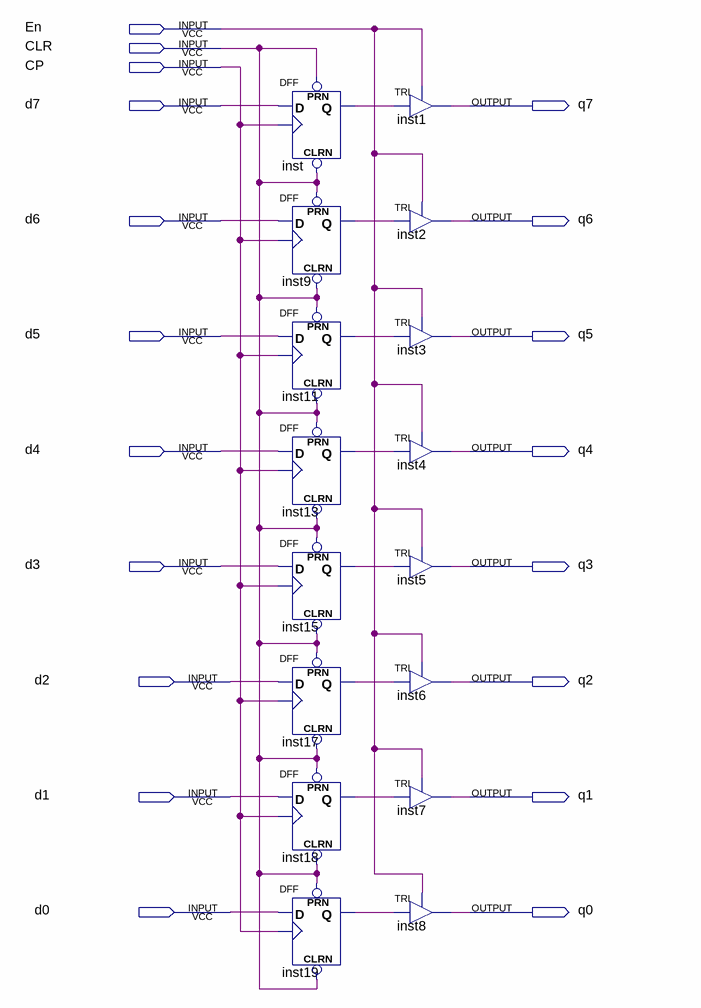
[diagram p0: schematic sheet]
// Quartus schematic TriEn.bdf as structural Verilog: 16 symbols, 19 pins
module TriEn (
  input  En,
  input  CLR,
  input  CP,
  input  d7,
  input  d6,
  input  d5,
  input  d4,
  input  d3,
  input  d2,
  input  d1,
  input  d0,
  output q7,
  output q6,
  output q5,
  output q4,
  output q3,
  output q2,
  output q1,
  output q0
);

  wire inst9_q, inst11_q, inst13_q, inst15_q, inst17_q, inst18_q, inst19_q, inst_q;

  DFF inst (.CLRN(CLR), .CLK(CP), .D(d7), .PRN(CLR), .Q(inst_q));
  DFF inst9 (.CLRN(CLR), .CLK(CP), .D(d6), .PRN(CLR), .Q(inst9_q));
  DFF inst11 (.CLRN(CLR), .CLK(CP), .D(d5), .PRN(CLR), .Q(inst11_q));
  DFF inst13 (.CLRN(CLR), .CLK(CP), .D(d4), .PRN(CLR), .Q(inst13_q));
  DFF inst15 (.CLRN(CLR), .CLK(CP), .D(d3), .PRN(CLR), .Q(inst15_q));
  DFF inst17 (.CLRN(CLR), .CLK(CP), .D(d2), .PRN(CLR), .Q(inst17_q));
  DFF inst18 (.CLRN(CLR), .CLK(CP), .D(d1), .PRN(CLR), .Q(inst18_q));
  DFF inst19 (.CLRN(CLR), .CLK(CP), .D(d0), .PRN(CLR), .Q(inst19_q));
  TRI inst1 (.IN(inst_q), .OE(En), .OUT(q7));
  TRI inst2 (.IN(inst9_q), .OE(En), .OUT(q6));
  TRI inst3 (.IN(inst11_q), .OE(En), .OUT(q5));
  TRI inst4 (.IN(inst13_q), .OE(En), .OUT(q4));
  TRI inst5 (.IN(inst15_q), .OE(En), .OUT(q3));
  TRI inst6 (.IN(inst17_q), .OE(En), .OUT(q2));
  TRI inst7 (.IN(inst18_q), .OE(En), .OUT(q1));
  TRI inst8 (.IN(inst19_q), .OE(En), .OUT(q0));
endmodule
